# Altium schematic sheet ARM.SchDoc
size A3; SheetNumber: 11; SheetTotal: 17
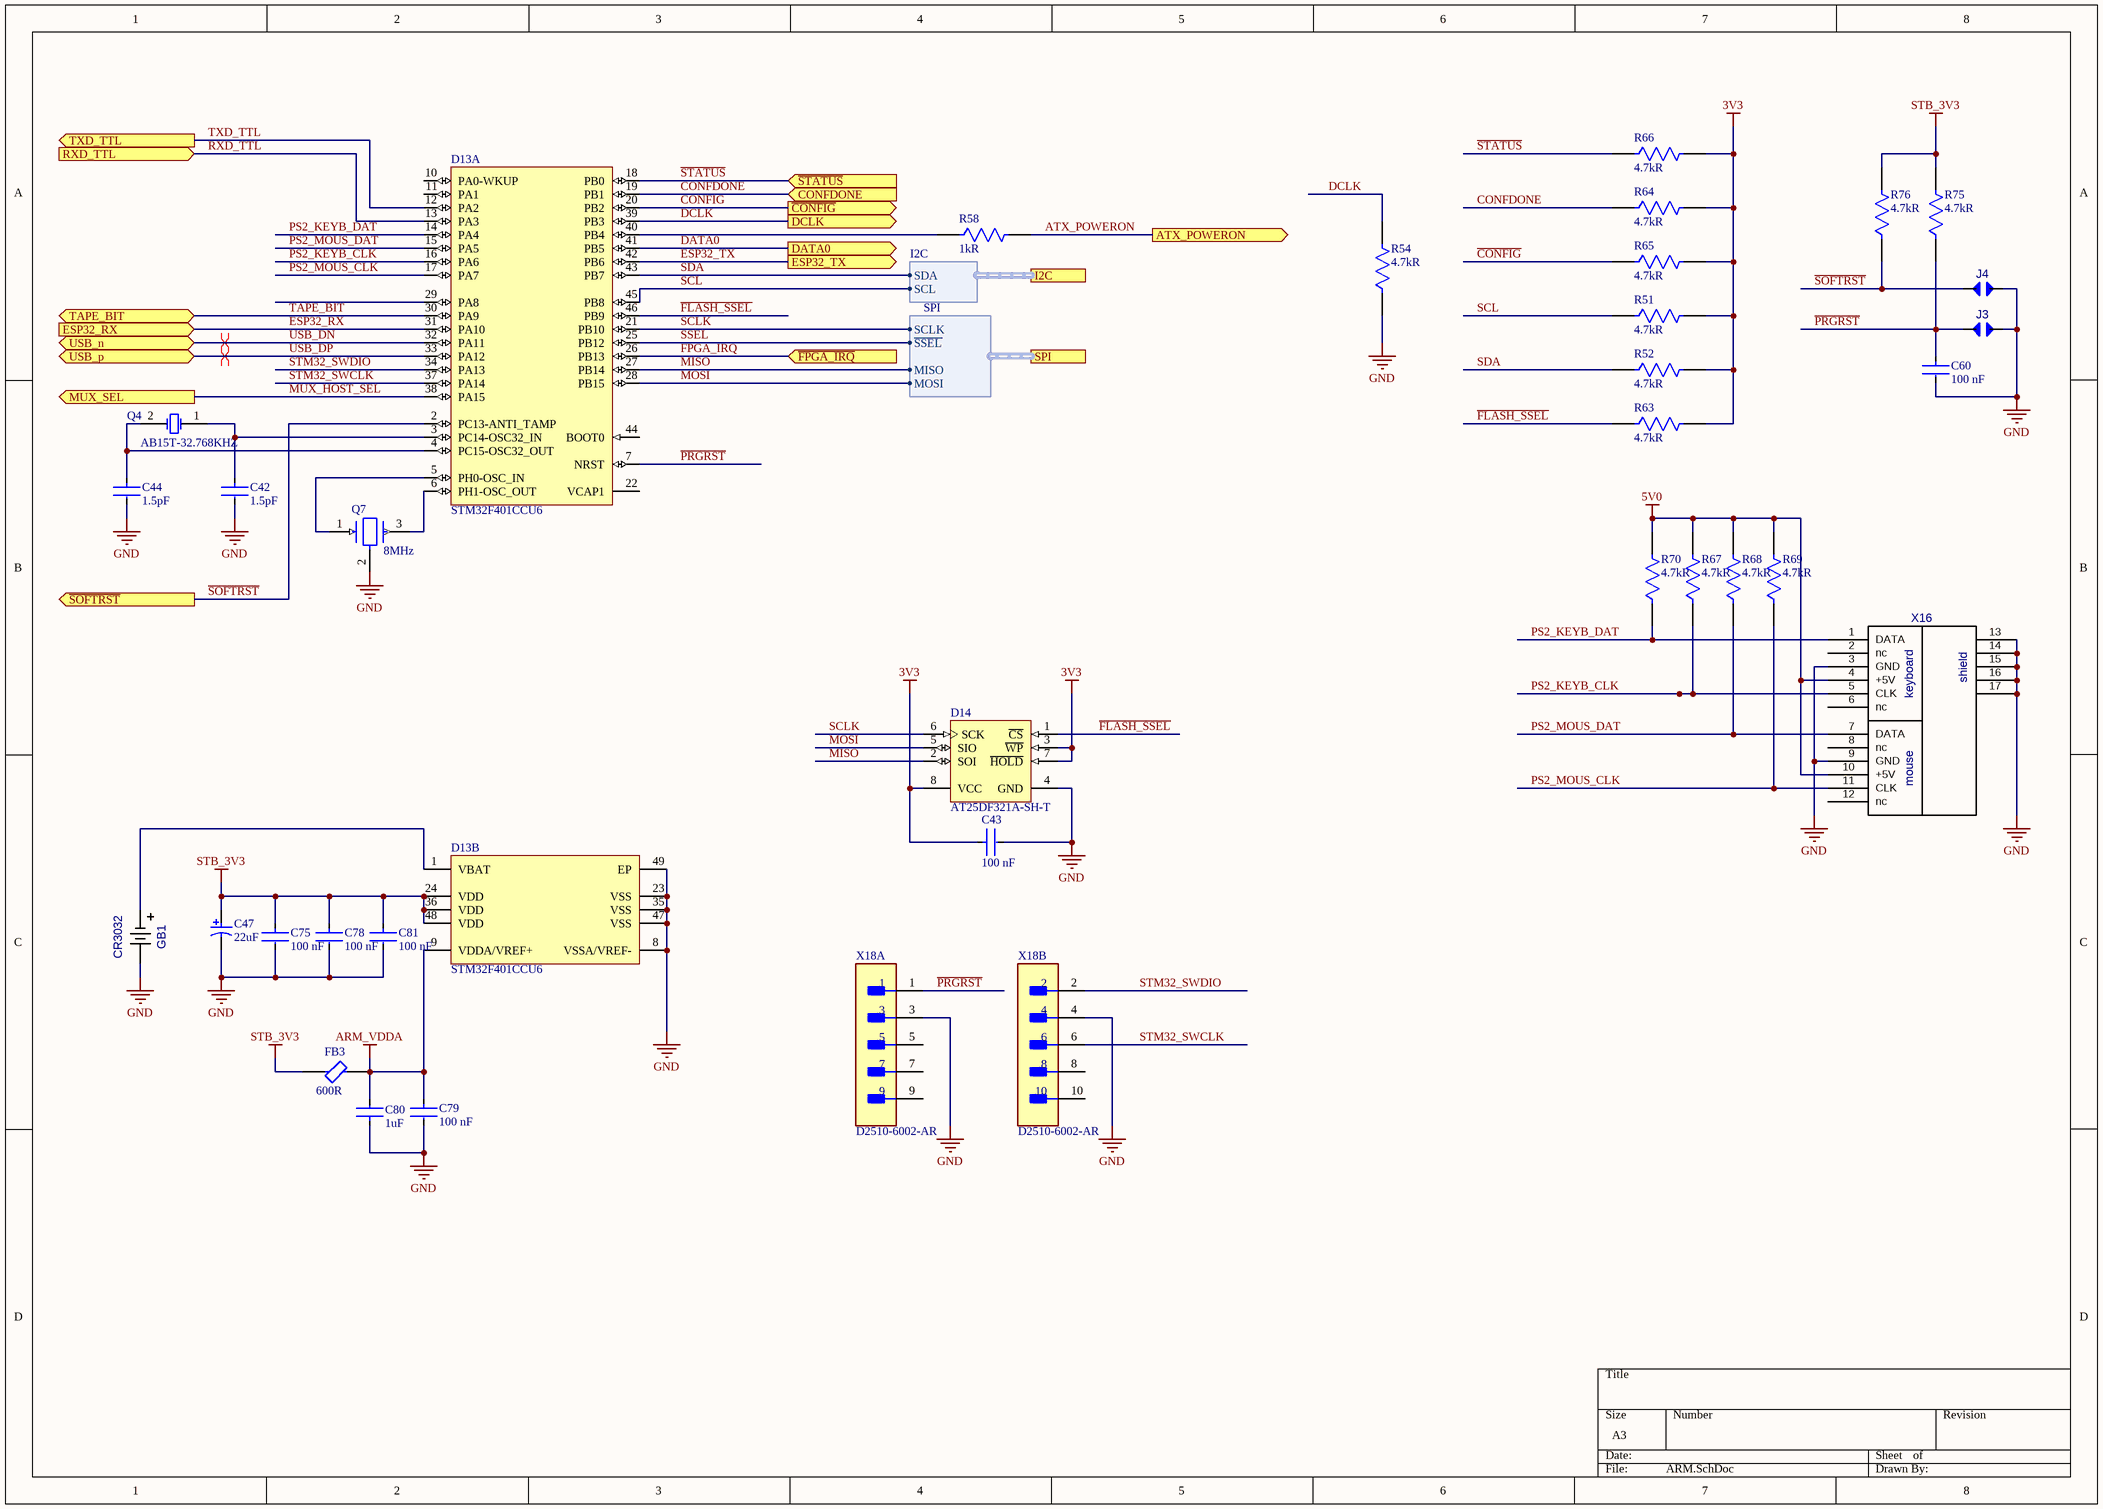
[diagram p0: ARM.SchDoc]

## Parts
C42  Capacitance: 1.5pF  [FP-CL21-IPC_A]  (hidden comment: CL21C1R5CBANNNC)
C43  Capacitance: 100 nF  [FP-CC0805-0_85-IPC_A]  (hidden comment: CC0805KRX7R8BB104)
C44  Capacitance: 1.5pF  [FP-CL21-IPC_A]  (hidden comment: CL21C1R5CBANNNC)
C47  Capacitance: 22uF  [AVX-TAJ-B-2_M]  (hidden comment: TAJB226K016RNJ)
C60  Capacitance: 100 nF  [FP-CC0805-0_85-IPC_A]  (hidden comment: CC0805KRX7R8BB104)
C75  Capacitance: 100 nF  [FP-CC0805-0_85-IPC_A]  (hidden comment: CC0805KRX7R8BB104)
C78  Capacitance: 100 nF  [FP-CC0805-0_85-IPC_A]  (hidden comment: CC0805KRX7R8BB104)
C79  Capacitance: 100 nF  [FP-CC0805-0_85-IPC_A]  (hidden comment: CC0805KRX7R8BB104)
C80  Capacitance: 1uF  [FP-GCM21B-0_15-IPC_A]  (hidden comment: GCM21BR71E105KA56L)
C81  Capacitance: 100 nF  [FP-CC0805-0_85-IPC_A]  (hidden comment: CC0805KRX7R8BB104)
D13  STM32F401CCU6  [STM-UFQFPN48_N]  (parts A,B of 2)
D14  AT25DF321A-SH-T  [ADST-S2-8_N]
FB3  Impedance: 600R  [FP-BLM21-0_2-t0_85-e0_5-IPC_A]  (hidden comment: BLM21AG601SN1J)
GB1  value CR3032  [BAT_Primary]  (hidden comment: BAT)
J3  JUMPER  [JUMPER]  (value not drawn)
J4  JUMPER  [JUMPER]  (value not drawn)
Q4  AB15T-32.768KHZ  [ABRA-AB15T-2_V]
Q7  Frequency: 8MHz  [FP-CSTNE8M00GH5C000R0-MFG]  (hidden comment: CSTNE8M00GH5C000R0)
R51  Resistance: 4.7kR  [FP-CR0805-IPC_A]  (hidden comment: CR0805-JW-472ELF)
R52  Resistance: 4.7kR  [FP-CR0805-IPC_A]  (hidden comment: CR0805-JW-472ELF)
R54  Resistance: 4.7kR  [FP-CR0805-IPC_A]  (hidden comment: CR0805-JW-472ELF)
R58  Resistance: 1kR  [FP-MCR10-IPC_A]  (hidden comment: MCR10ERTJ102)
R63  Resistance: 4.7kR  [FP-CR0805-IPC_A]  (hidden comment: CR0805-JW-472ELF)
R64  Resistance: 4.7kR  [FP-CR0805-IPC_A]  (hidden comment: CR0805-JW-472ELF)
R65  Resistance: 4.7kR  [FP-CR0805-IPC_A]  (hidden comment: CR0805-JW-472ELF)
R66  Resistance: 4.7kR  [FP-CR0805-IPC_A]  (hidden comment: CR0805-JW-472ELF)
R67  Resistance: 4.7kR  [FP-CR0805-IPC_A]  (hidden comment: CR0805-JW-472ELF)
R68  Resistance: 4.7kR  [FP-CR0805-IPC_A]  (hidden comment: CR0805-JW-472ELF)
R69  Resistance: 4.7kR  [FP-CR0805-IPC_A]  (hidden comment: CR0805-JW-472ELF)
R70  Resistance: 4.7kR  [FP-CR0805-IPC_A]  (hidden comment: CR0805-JW-472ELF)
R75  Resistance: 4.7kR  [FP-CR0805-IPC_A]  (hidden comment: CR0805-JW-472ELF)
R76  Resistance: 4.7kR  [FP-CR0805-IPC_A]  (hidden comment: CR0805-JW-472ELF)
X16  KEYB-MOUSE  [MDD-6FR]  (value not drawn)
X18  D2510-6002-AR  [FP-D2510-6002-AR-MFG]  (parts A,B of 2)

## Ports
ATX_POWERON (out), CONFDONE (in), DATA0 (out), DCLK (out), ESP32_RX (in), ESP32_TX (out), I2C (harness I2C), MUX_SEL (out), RXD_TTL (in), SPI (harness SPI), TAPE_BIT (bidir), TXD_TTL (out), USB_n (bidir), USB_p (bidir), ~{CONFIG} (out), ~{FPGA_IRQ} (in), ~{SOFTRST} (out), ~{STATUS} (in)

## Harnesses
SPI: ~{SSEL}, SCLK, MOSI, MISO
I2C: SDA, SCL

## Nets
3V3: C43.1 D14.3(~{WP}) D14.7(~{HOLD}) D14.8(VCC) R51.2 R52.2 R63.2 R64.2 R65.2 R66.2
5V0: R67.2 R68.2 R69.2 R70.2 X16.4(+5V) X16.10(+5V)
ARM_VDDA: C79.1 C80.2 D13.9(VDDA/VREF+) FB3.2
GND: C42.2 C43.2 C44.2 C47.2 C60.2 C75.2 C78.2 C79.2 C80.1 C81.2 D13.8(VSSA/VREF-) D13.23(VSS) D13.35(VSS) D13.47(VSS) D13.49(EP) D14.4(GND) GB1.2(MINUS) J3.1 J4.1 Q7.2(GND) R54.1 X16.3(GND) X16.9(GND) X16.13(shield) X16.14(shield) X16.15(shield) X16.16(shield) X16.17(shield) X18.3 X18.4
STB_3V3: C47.1 C75.1 C78.1 C81.1 D13.24(VDD) D13.36(VDD) D13.48(VDD) FB3.1 R75.2 R76.2
ATX_POWERON: R58.2 ; port ATX_POWERON
~{CONFIG}: D13.20(PB2) R65.1 ; port ~{CONFIG}
CONFDONE: D13.19(PB1) R64.1 ; port CONFDONE
DATA0: D13.41(PB5) ; port DATA0
DCLK: D13.39(PB3) R54.2 ; port DCLK
ESP32_RX: D13.31(PA10) ; port ESP32_RX
ESP32_TX: D13.42(PB6) ; port ESP32_TX
~{FLASH_SSEL}: D13.46(PB9) D14.1(~{CS}) R63.1
~{FPGA_IRQ}: D13.26(PB13) ; port ~{FPGA_IRQ}
MISO: D13.27(PB14) D14.2(SOI) ; port SPI.MISO
MOSI: D13.28(PB15) D14.5(SIO) ; port SPI.MOSI
MUX_HOST_SEL: D13.38(PA15) ; port MUX_SEL
~{PRGRST}: C60.1 D13.7(NRST) J3.0 R75.1 X18.1
PS2_KEYB_CLK: D13.16(PA6) R67.1 X16.5(CLK)
PS2_KEYB_DAT: D13.14(PA4) R70.1 X16.1(DATA)
PS2_MOUS_CLK: D13.17(PA7) R69.1 X16.11(CLK)
PS2_MOUS_DAT: D13.15(PA5) R68.1 X16.7(DATA)
RXD_TTL: D13.13(PA3) ; port RXD_TTL
~{SOFTRST}: D13.2(PC13-ANTI_TAMP) J4.0 R76.1 ; port ~{SOFTRST}
~{SSEL}: D13.25(PB12) ; port SPI.~{SSEL}
~{STATUS}: D13.18(PB0) R66.1 ; port ~{STATUS}
SCL: D13.45(PB8) R51.1 ; port I2C.SCL
SCLK: D13.21(PB10) D14.6(SCK) ; port SPI.SCLK
SDA: D13.43(PB7) R52.1 ; port I2C.SDA
STM32_SWCLK: D13.37(PA14) X18.6
STM32_SWDIO: D13.34(PA13) X18.2
TAPE_BIT: D13.30(PA9) ; port TAPE_BIT
TXD_TTL: D13.12(PA2) ; port TXD_TTL
USB_DN: D13.32(PA11) ; port USB_n
USB_DP: D13.33(PA12) ; port USB_p
NetC42_1: C42.1 D13.3(PC14-OSC32_IN) Q4.1(X1)
NetC44_1: C44.1 D13.4(PC15-OSC32_OUT) Q4.2(X2)
NetD13_1: D13.1(VBAT) GB1.1(PLUS)
NetD13_5: D13.5(PH0-OSC_IN) Q7.1(Input)
NetD13_6: D13.6(PH1-OSC_OUT) Q7.3(Output)
NetD13_40: D13.40(PB4) R58.1

Not connected (* = marked no-connect by the designer): D13 10(PA0-WKUP) 11(PA1) 22(VCAP1) 29(PA8) 44(BOOT0); X16 2(nc) 6(nc) 8(nc) 12(nc); X18 5 7 8 9 10

## Layout directives
differential pair: USB_DN, USB_DP

## Notes on the sheet
- (in symbol KEYB-MOUSE) keyboard; mouse

## Library data of the parts
C42 C44 = CMP-13271-001925-1: CL21 Series 0805 1.5pF 50V ±0.25pF Tolerance C0G Multilayer Ceramic Chip Capacitor; Temperature Coefficient: 300ppm/°C; Case Code (Metric): 2012; Voltage: 50V; Voltage Rating: 50V; Height: 0.65mm; Min Operating Temperature: -55°C; Radiation Hardening: No; Case/Package: 0805; Lead Free: Lead Free; Packaging: Tape and Reel; Package Quantity: 1; Dielectric: C0G; Width: 0.049inch; Thickness: 0.03inch; Mount: Surface Mount; Length: 2mm; Voltage Rating (DC): 50V; Depth: 1.25mm; Material: Ceramic; Max Operating Temperature: 125°C; Case Code (Imperial): 0805
C43 C60 C75 C78 C79 C81 = CMP-1036-04410-2: CAP CER 0.1UF 25V X7R 0805; Manufacturer: Yageo; Tolerance: 0.1; Material: Ceramic; Value: 100 nF; ComponentLink2URL: http://www.yageo.com/documents/recent/UPY-GPHC_Y5V_6.3V-to-50V_8.pdf; Category: Cap; Mouser Description: Multilayer Ceramic Capacitors MLCC - SMD/SMT 100nF 25V X7R 10%; Manufacturer Part Number: CC0805KRX7R8BB104; Device Class L1: Passive Components; Footprint Url: http://www.yageo.com/exep/pages/download/literatures/UPY-C_GEN_24.pdf; Height: 0.95mm; Digikey Description: CAP CER 0.1UF 25V X7R 0805; Lead Free: Yes; Temperature Range High: +85°C; Temperature: -30°C to +85°C; Ipc Land Pattern Name: CAPC200125X85; Automotive: No; Octopart: https://octopart.com/cc0805krx7r8bb104-yageo-39467766; Device Class L2: Capacitors; Temperature Characteristic: X7R; Voltage Rating: 25 V; ComponentLink2Description: Datasheet; Temperature Range Low: -30°C; Device Class L3: Ceramic Capacitors; RoHS: TRUE; Package: CC0805-0.85
C47 = CMP-2100-03689-1: Standard Tantalum, 22 uF, +/- 10%, 16 V, -55 to 125 degC, 2-Pin SMD (1210), RoHS, Tape and Reel; Manufacturer: AVX; Leakage Current: 3.5uA; Dissipation Factor: 6%; Voltage Rating (DC): 16V; ESR (Equivalent Series Resistance): 2.3Ohm; Polarity: Polar; Package Quantity: 1; Tolerance: 10%; Number of Pins: 2; Manufacturer URL: http://www.avx.com/; Height - Seated (Max): 0.083inch; Case Code (Imperial): 1210; Package Reference: TAJ-B-2; Height: 1.9mm; Depth: 2.8mm; Packaging: TapeandReel; Termination: SMD/SMT; Case/Package: 1210; Lead Free: LeadFree; Min Operating Temperature: -55degC; RoHSCompliant: True; Dielectric Material: Tantalum; Case Code (Metric): 3528; Width: 2.8mm; Datasheet URL: http://datasheets.avx.com/TAJ.pdf; Radiation Hardening: No; Package Description: 2-Pin Surface Mount Device, Body 3.5 x 2.85 mm; Length: 3.5mm; Voltage Rating: 16V; Datasheet Version: 42401.0; Max Operating Temperature: 125degC; REACH SVHC: NoSVHC; Voltage: 16V
C80 = CMP-2007-03346-2: Ceramic Capacitor for Automotive 1uF ±10% 25VDC X7R 0805 Embossed T/R; Voltage Rating (DC): 25V; Dielectric: X7R; Max Operating Temperature: 125°C; Lead Free: Lead Free; Ratings: AEC-Q200; Voltage Rating: 25V; Case Code (Imperial): 0805; Package Quantity: 3000; Termination: SMD/SMT; Packaging: Tape and Reel; Tolerance: 10%; Length: 2mm; Voltage: 25V; Radiation Hardening: No; Depth: 1.25mm; Case/Package: 0805; Thickness: 0.055inch; Width: 0.049inch; Min Operating Temperature: -55°C; Mount: Surface Mount; REACH SVHC: No SVHC; Case Code (Metric): 2012; Height: 1.25mm
D13 = CMP-0243-00119-2: ARM Cortex-M4 32-bit MCU+FPU, 105 DMIPS, 256 kB Flash, 64 kB Internal RAM, 36 I/Os, 48-pin UFQFPN, -40 to 85 degC, Tray; Manufacturer: STMicroelectronics; Supply Voltage(Vcc) max (V): 3.6; I/Os (High Current): 36; Internal RAM Size (kB): 64; Operating Frequency(F) (Processor speed) (MHz): 84; FLASH Size (Prog) (kB): 256; Supply Voltage(Vcc) min (V): 1.8; Packing: Tray; PackageReference: UFQFPN48; PackageVersion: Rev. 1, 04/2013; Core: ARM Cortex-M4; ComponentLink1Description: Manufacturer URL; ComponentLink3Description: Package Specification; PackageDescription: 48-Pin Ultra Thin Fine Pitch Quad Flat No-Lead, 7 x 7 x 0.6 mm Body, 0.5 mm Pitch, Exposed Pad; Mounting Technology: Surface Mount; ComponentLink2URL: http://www.st.com/st-web-ui/static/active/en/resource/technical/document/data_brief/DM00071938.pdf; DatasheetVersion: Rev. 1; ComponentLink2Description: Datasheet; ComponentLink1URL: http://www.st.com/web/en/home.html; PartNumber: STM32F401CCU6; ComponentLink3URL: http://www.st.com/st-web-ui/static/active/en/resource/technical/document/data_brief/DM00071938.pdf; Manufacturer Part Number: STM32F401CCU6
D14 = CMP-0005-00011-1: SPI Serial Flash Memory, 32 Megabit, 100 MHz, 2.7 to 3.6 V, -40 to 85 degC, 8-Pin SOIC (S2-8), RoHS, Tape and Reel; Manufacturer: Adesto; Max. Freq: 100 MHz; DatasheetVersion: Rev. 3686E; Interface: Serial; Packing: Tape and Reel; Mounting Technology: Surface Mount; Device Density: 32 Megabit; PackageDescription: 8-Pin Plastic Gull Wing Small Outline Package, Body 5.24 x 5.29 mm, Pitch 1.27 mm; PackageReference: S2-8; ComponentLink3URL: http://www.adestotech.com/sites/default/files/datasheets/doc3668.pdf; ComponentLink1Description: Manufacturer URL; Operating Voltage: 2.7 to 3.6 V; ComponentLink2Description: Datasheet; Operating Temperature: -40 to 85 degC; PackageVersion: Rev. F; ComponentLink3Description: Package Specification; ComponentLink1URL: http://www.adestotech.com/; RoHS: TRUE; PartNumber: AT25DF321A-SH-T; ComponentLink2URL: http://www.adestotech.com/sites/default/files/datasheets/doc3686.pdf
FB3 = CMP-0686-00643-3: Chip Ferrite Bead, 0805, 600Ω @ 100MHz, 0.2Ω, 25%, 700mA; Current Rating: 600mA; DC Resistance (DCR): 210mR; Max Current Rating: 200mA; Number of Circuits: 1; RoHS Compliant: Yes; Test Frequency: 100MHz; Number of Pins: 2; Case Code (Metric): 2012; Depth: 0.85mm; Height: 1.25mm; Case Code (Imperial): 0805; Case/Package: 0805; DC Current: 200mA; Max Operating Temperature: 125°C; Core Material: Ferrite; Length: 2.2mm; Tolerance: 25%; Packaging: Tape and Reel; Min Operating Temperature: -55°C; Radiation Hardening: No; Termination: Flat
J3 = JUMPER: Hard Reset Key; Value: *
J4 = JUMPER: Soft Reset Key
Q4 = CMP-1326-00001-1: Low Frequency Cylindrical Watch Crystal, 32.768 kHz, -20 to 70 degC, 2-Pin 5 x 1.4 x 1.5 mm THD, RoHS, Bulk; Manufacturer: Abracon; ESR: 40 KOhm Max.; Shunt Capacitance C0: 1 pF Typ.; Load Capacitance CL: 12.5 pF; ComponentLink1URL: http://www.abracon.com/; Temperature Range: -20 to 70 degC; ComponentLink1Description: Manufacturer URL; PackageDescription: 2-Pin THD, Body 5 x 1.4 mm, Pin Spacing 0.45 mm; Frequency: 32.768 kHz; ComponentLink2URL: http://www.abracon.com/Resonators/AB15T.pdf; ComponentLink2Description: Datasheet; ComponentLink3Description: Package Specification; DatasheetVersion: Jun-10; Packing: Bulk; Mounting Technology: Through Hole; RoHS: TRUE; PartNumber: AB15T-32.768KHZ; ComponentLink3URL: http://www.abracon.com/Resonators/AB15T.pdf
Q7 = CMP-06057-000001-1: CERAMIC RES 8.0000MHZ 33PF SMD; Frequency Stability: 0.13%; Frequency Tolerance: 0.07%; Impedance: 40R; Mount: Surface Mount; Min Operating Temperature: -40°C; Max Operating Temperature: 125°C; Resistor Type: Ceramic; Capacitance: 33pF; Packaging: Tape and Reel; Case/Package: SMD/SMT
R51 R52 R54 R63-R70 R75 R76 = CMP-07231-004713-1: Thick Film Chip Resistors 0805 4.7kΩ 0.125W 5% 200ppm/°C; Max Power Dissipation: 125mW; Voltage Rating: 150V; Height: 0.024inch; Case/Package: 0805; Packaging: Tape and Reel; Radiation Hardening: No; Tolerance: 5%; Case Code (Metric): 2012; Number of Terminations: 2; Mount: Surface Mount; Termination: SMD/SMT; REACH SVHC: No SVHC; Length: 2mm; Temperature Coefficient: 200ppm/°C; Composition: Thick Film; Contact Plating: Tin; Case Code (Imperial): 0805; Thickness: 508um; Package Quantity: 1; Features: Moisture Resistant; Depth: 1.25mm; Max Operating Temperature: 155°C; Power Rating: 125mW; Voltage Rating (DC): 150V; Width: 0.049inch; Min Operating Temperature: -55°C; Military Standard: Not
R58 = CMP-08839-004390-1: Thick Film Chip Resistor, 0805, 1kΩ, 5%, 200ppm/°C, 0.125W, 150V; Max Power Dissipation: 125mW; RoHS Compliant: Yes; Height: 0.024inch; Case/Package: 0805; Max Operating Temperature: 155°C; Package Quantity: 1; Length: 0.079inch; Number of Terminations: 2; Packaging: Cut Tape; Case Code (Metric): 2012; Resistor Type: Thick Film; Min Operating Temperature: -55°C; Voltage Rating (DC): 150V; Tolerance: 5%; Case Code (Imperial): 0805; Width: 0.049inch; Temperature Coefficient: 200ppm/°C; Series: MCR10
X18 = CMP-05379-000002-1: CONN HEADER VERT 10POS 2.54MM; Manufacturer: 3M; Conn Gender: Male; Number Of Contacts: 10; Conn Orientation: Straight; Current Rating: 1.75A; Temperature: -55°C to +105°C; Temperature Range High: +105°C; Automotive: No; Device Class L2: Headers and Wire Housings; Mouser Description: Headers & Wire Housings 10P 4WALL HEADER STRT L-PRO THRU-HOLE; Category: Conn; Lead Free: Yes; Manufacturer Part Number: D2510-6002-AR; Octopart: https://octopart.com/d2510-6002-ar-3m-8399032; Temperature Range Low: -55°C; ComponentLink2URL: http://multimedia.3m.com/mws/media/485877O/3m-four-wall-header-d2500-series-ts-2244.pdf; Package: D2510-6002-AR; RoHS: TRUE; Pitch: 2.54mm; Contact Material: Gold,Nickel; Height: 10.04mm; ComponentLink2Description: Datasheet; Device Class L1: Connectors; Digikey Description: CONN HEADER VERT 10POS 2.54MM; Device Class L3: unset; Number Of Rows: 2
X16 = KEYB-MOUSE: Value: *